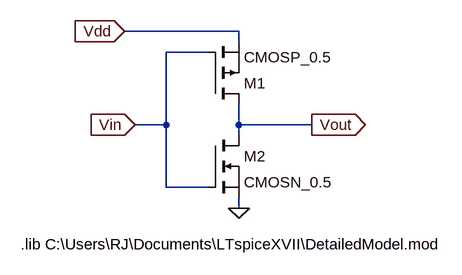
[diagram p0: schematic Draft1.asc]
Draft1.asc, the LTspice schematic file:
Version 4
SHEET 1 880 680
WIRE 224 32 48 32
WIRE 224 48 224 32
WIRE 176 64 112 64
WIRE 112 176 112 64
WIRE 112 176 64 176
WIRE 224 176 224 144
WIRE 336 176 224 176
WIRE 224 192 224 176
WIRE 112 272 112 176
WIRE 176 272 112 272
WIRE 224 304 224 288
FLAG 224 304 0
FLAG 64 176 Vin
IOPIN 64 176 In
FLAG 48 32 Vdd
IOPIN 48 32 In
FLAG 336 176 Vout
IOPIN 336 176 Out
SYMBOL pmos 176 144 M180
SYMATTR InstName M1
SYMATTR Value CMOSP_0.5
SYMBOL nmos 176 192 R0
SYMATTR InstName M2
SYMATTR Value CMOSN_0.5
TEXT -112 360 Left 2 !.lib C:\\Users\\RJ\\Documents\\LTspiceXVII\\DetailedModel.mod

The netlist it stands for:
* Draft1.asc
M1 Vout Vin Vdd Vdd CMOSP_0.5
M2 Vout Vin 0 0 CMOSN_0.5
.model NMOS NMOS
.model PMOS PMOS
.lib standard.mos
.lib C:\Users\RJ\Documents\LTspiceXVII\DetailedModel.mod
.backanno
.end